# EAGLE schematic AQ_sensor_GSM (EAGLE 9.6.2)

## Sheet 1 of 6: Control Board
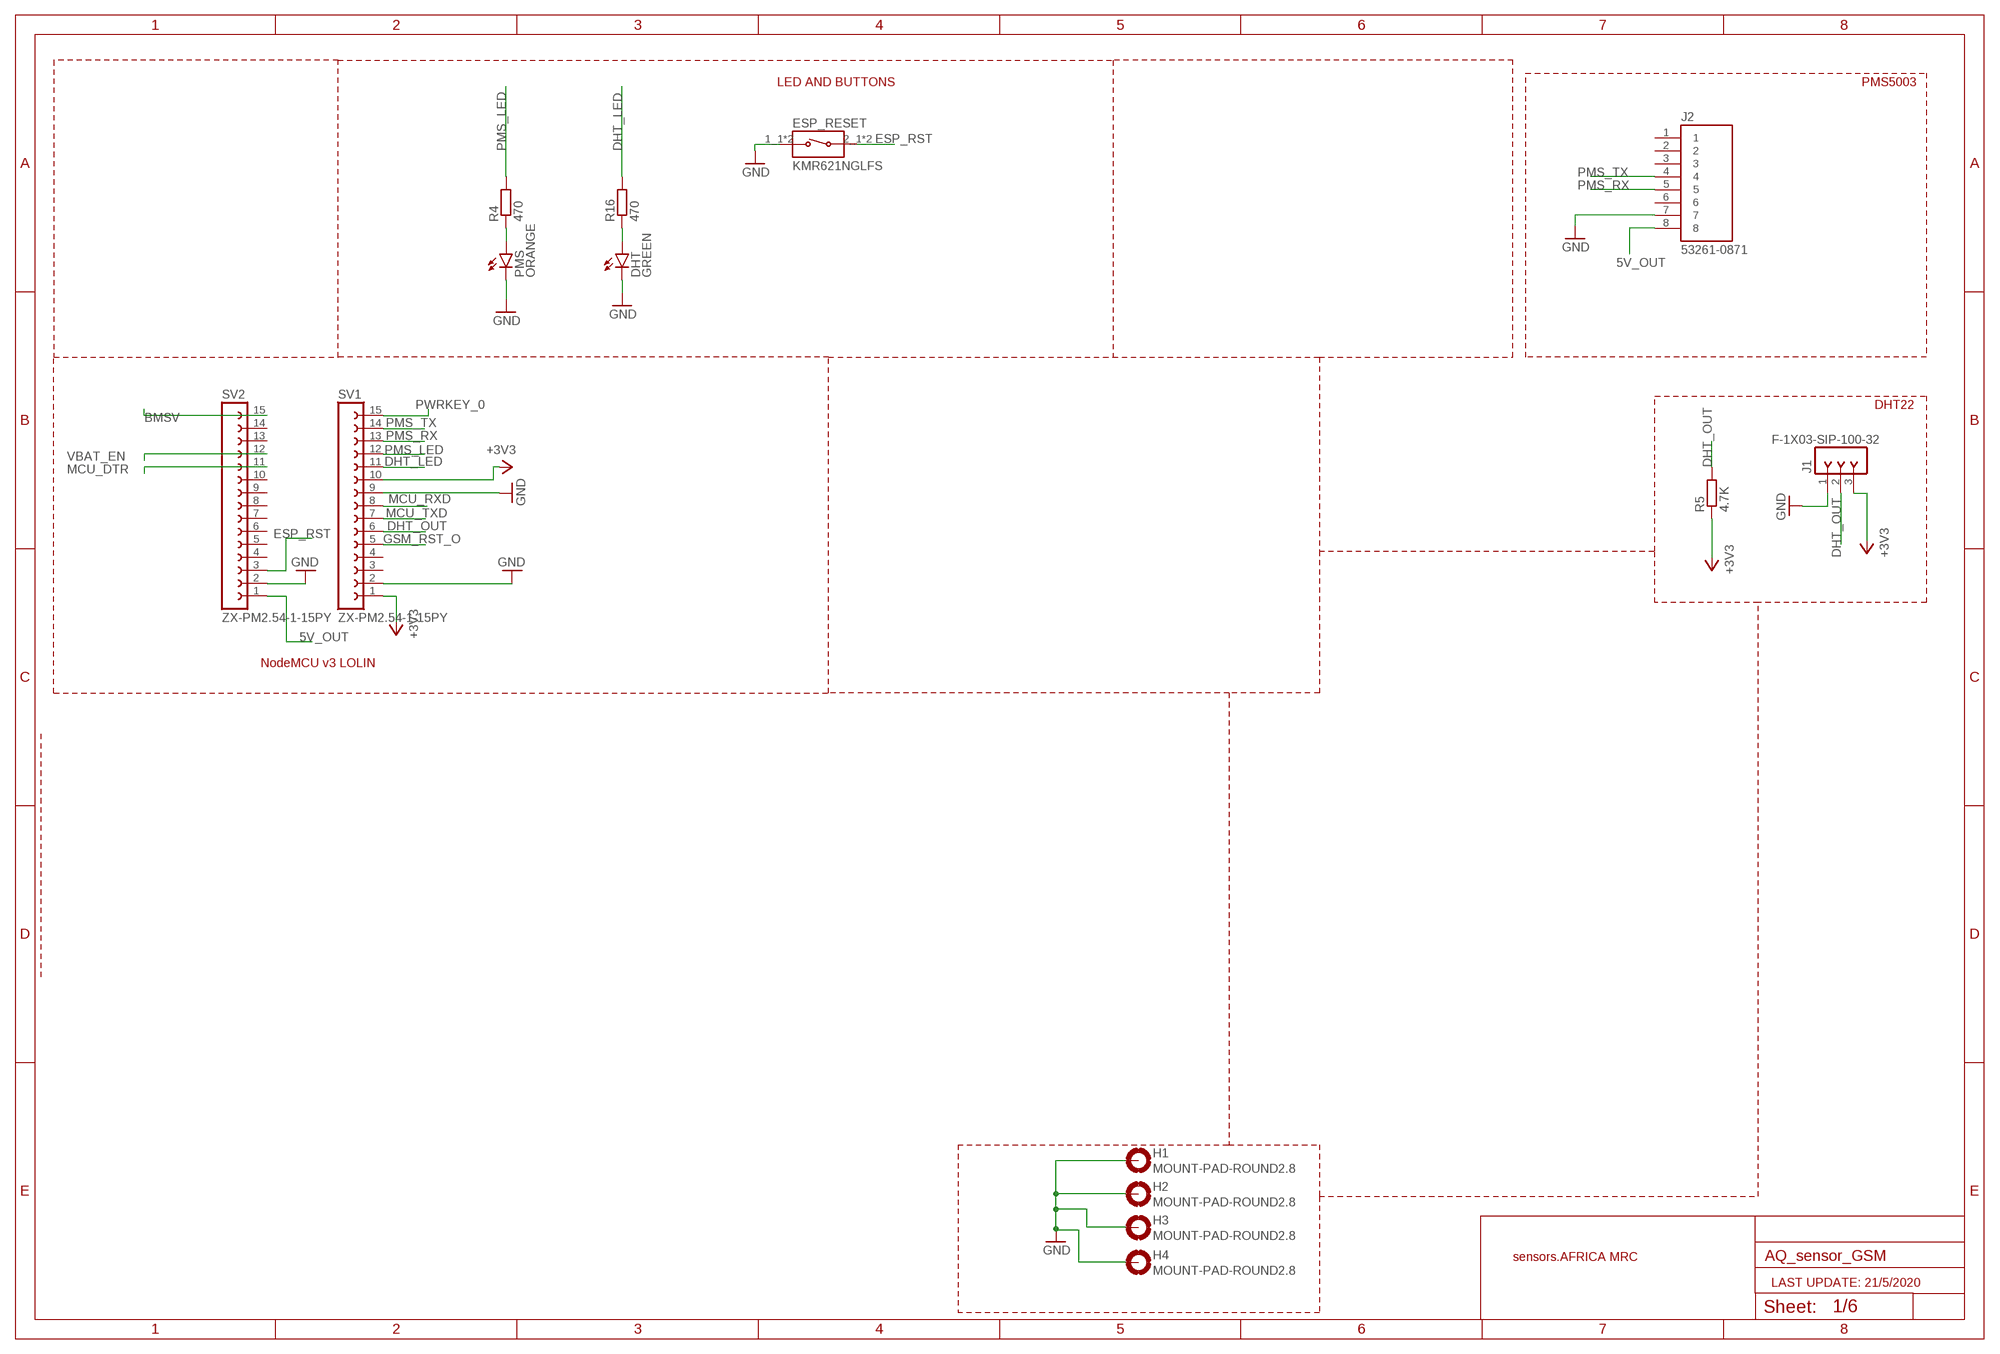
[diagram p0: schematic, sheet 1]

### Parts
DHT  GREEN  LEDCHIP-LED0603  [CHIP-LED0603]
ESP_RESET  KMR621NGLFS  [SW_KMR621NGLFS]
H1  MOUNT-PAD-ROUND2.8  [2,8-PAD]
H2  MOUNT-PAD-ROUND2.8  [2,8-PAD]
H3  MOUNT-PAD-ROUND2.8  [2,8-PAD]
H4  MOUNT-PAD-ROUND2.8  [2,8-PAD]
J1  F-1X03-SIP-100-32  [SIP-100-03-32]
J2  53261-0871  [MOLEX_53261-0871]
PMS  ORANGE  LEDCHIP-LED0603  [CHIP-LED0603]
R4  470  R-EU_R0603  [R0603]
R5  4.7K  R-EU_R0603  [R0603]
R16  470  R-EU_R0603  [R0603]
SV1  ZX-PM2.54-1-15PY  FE15-1  [FE15]
SV2  ZX-PM2.54-1-15PY  FE15-1  [FE15]

### Nets
5V_OUT [HCurrent]: J2.8 SV2.1 ; also sheet 4
+3V3 [POWER]: J1.3 R5.1 SV1.1 SV1.10 ; also sheet 2,4
BMSV: SV2.15 ; also sheet 4
DHT_LED: R16.2 SV1.11
DHT_OUT: J1.2 R5.2 SV1.6
ESP_RST: ESP_RESET.2_1 ESP_RESET.2_2 SV2.3
GND: DHT.C ESP_RESET.1_1 ESP_RESET.1_2 H1.B2,8(MOUNT) H2.B2,8(MOUNT) H3.B2,8(MOUNT) H4.B2,8(MOUNT) J1.1 J2.7 PMS.C SV1.2 SV1.9 SV2.2 ; also sheet 2,3,4,5
GSM_RST_O: SV1.5 ; also sheet 2
MCU_DTR: SV2.11 ; also sheet 2
MCU_RXD: SV1.8 ; also sheet 2,3
MCU_TXD: SV1.7 ; also sheet 2,3
N$4: PMS.A R4.1
N$27: DHT.A R16.1
PMS_LED: R4.2 SV1.12
PMS_RX: J2.5 SV1.13
PMS_TX: J2.4 SV1.14
PWRKEY_0: SV1.15 ; also sheet 2
VBAT_EN: SV2.12
Unconnected: J2.1 J2.2 J2.3 J2.6 SV1.3 SV1.4 SV2.4 SV2.5 SV2.6 SV2.7 SV2.8 SV2.9 SV2.10 SV2.13 SV2.14

### Notes on the sheet
- LED AND BUTTONS | PMS5003
- DHT22
- NodeMCU v3 LOLIN
- sensors.AFRICA MRC
- LAST UPDATE: 21/5/2020

## Sheet 2 of 6: Protection and Logic Level Converters
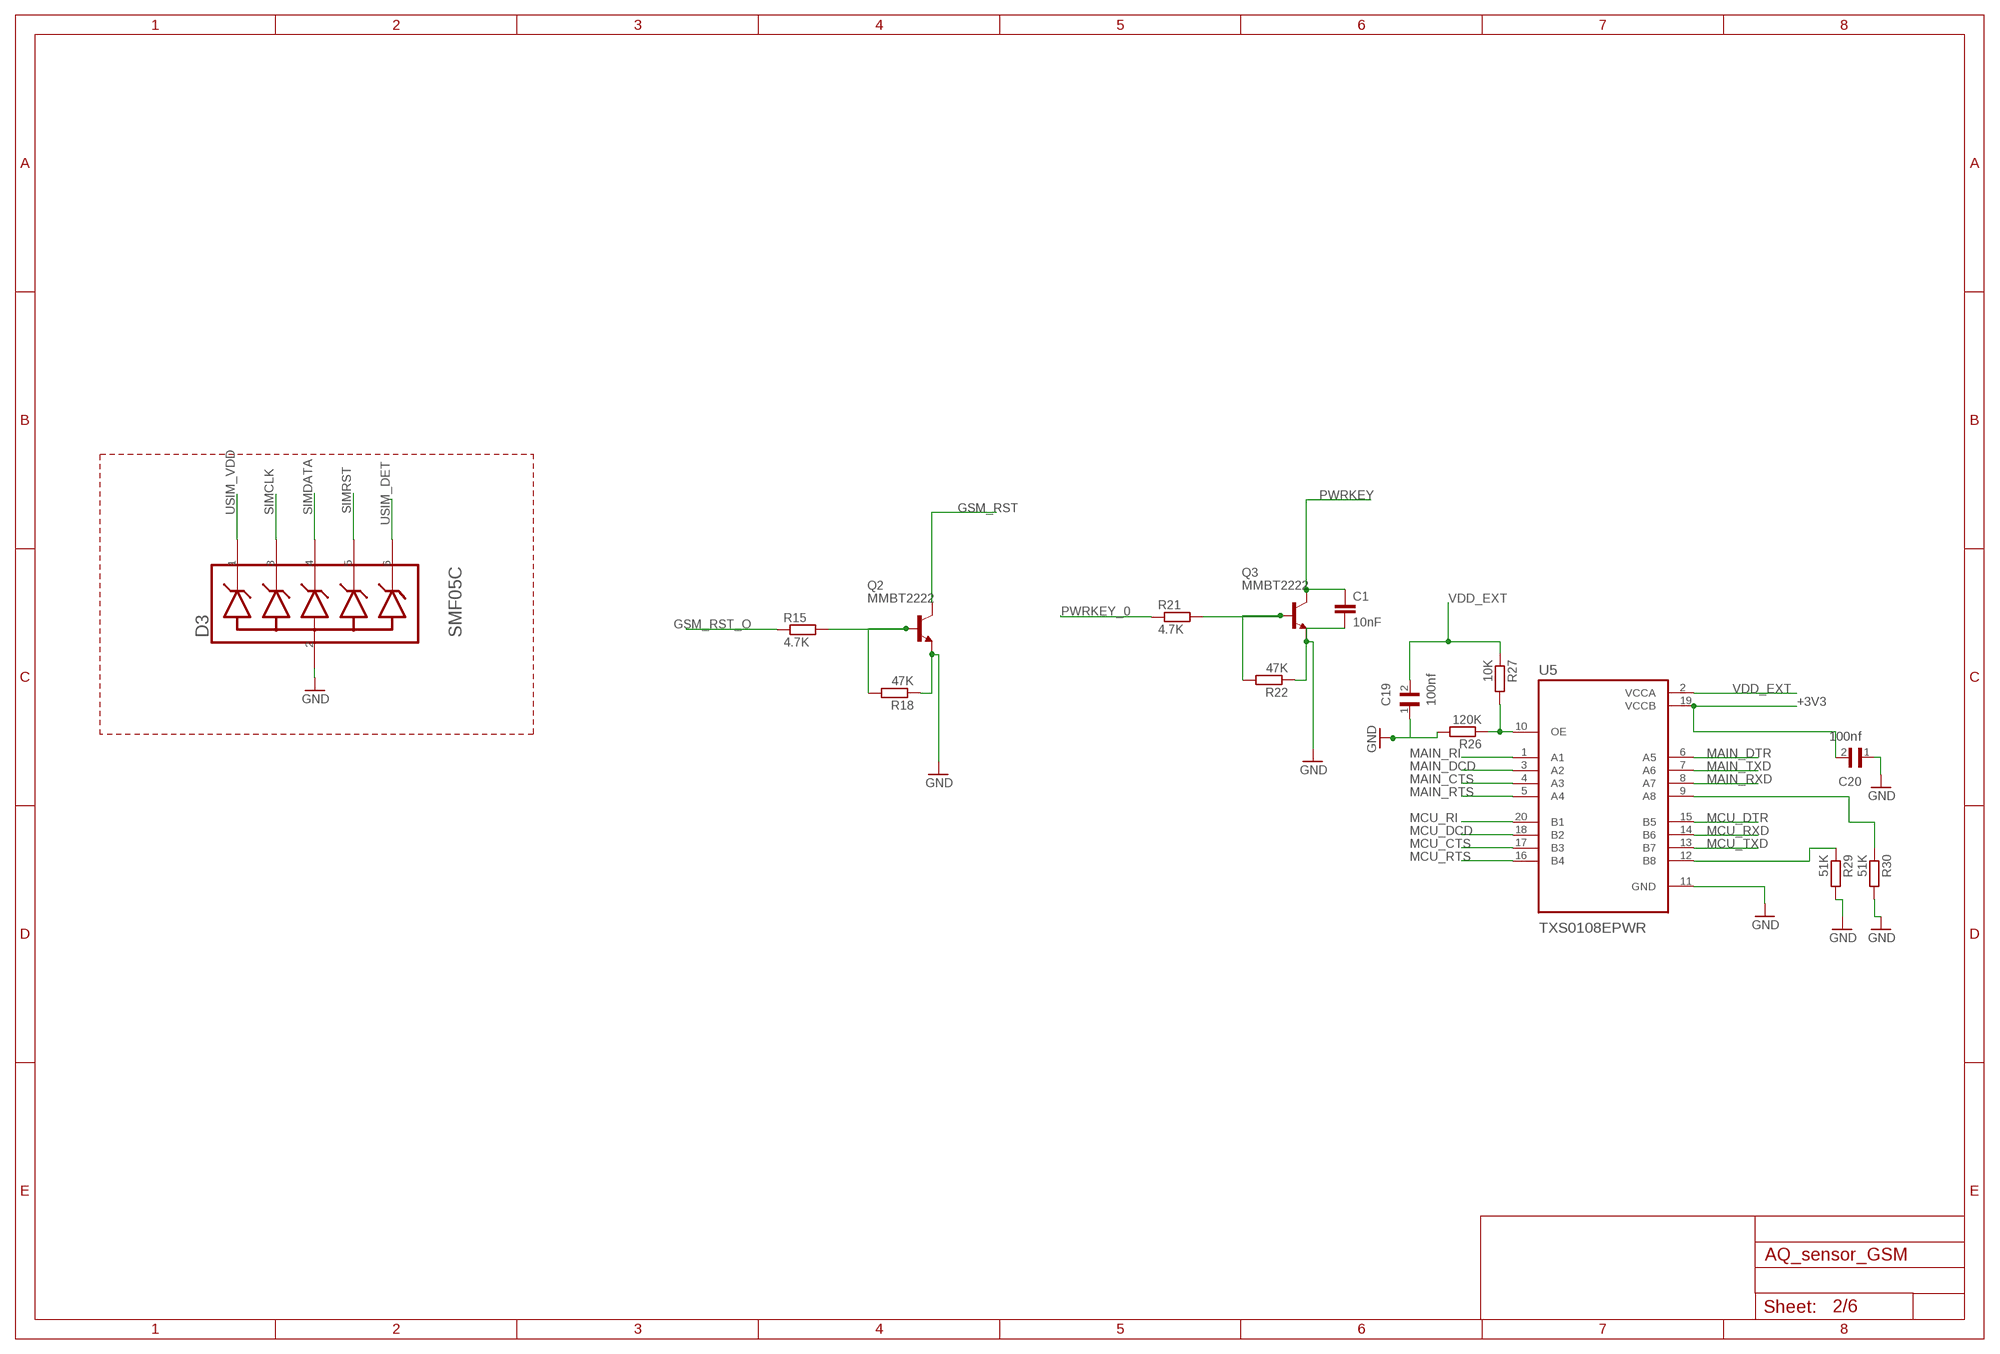
[diagram p1: schematic, sheet 2]

### Parts
C1  10nF  10NF-0603-50V-10%  [0603]
C19  100nf  06035C104K4T2A  [CAPC1608X90N]
C20  100nf  06035C104K4T2A  [CAPC1608X90N]
D3  SEMTECH_SMF05CSEMTECH_SMF05C_0_0  [SEMTECH_SMF05C_0]
Q2  MMBT2222  [SOT23-BEC]
Q3  MMBT2222  [SOT23-BEC]
R15  4.7K  R-EU_R0603  [R0603]
R18  47K  R-EU_R0603  [R0603]
R21  4.7K  R-EU_R0603  [R0603]
R22  47K  R-EU_R0603  [R0603]
R26  120K  R-EU_R0603  [R0603]
R27  10K  R-EU_R0603  [R0603]
R29  51K  R-EU_R0603  [R0603]
R30  51K  R-EU_R0603  [R0603]
U5  TXS0108EPWR  [SOP65P640X120-20N]

### Nets
+3V3 [POWER]: C20.2 U5.19(VCCB) ; also sheet 1,4
GND: C1.2 C19.1 C20.1 D3.2(ANODE) Q2.E Q3.E R18.1 R22.1 R26.2 R29.2 R30.2 U5.11(GND) ; also sheet 1,3,4,5
GSM_RST [BGA]: Q2.C ; also sheet 3,5
GSM_RST_O: R15.1 ; also sheet 1
MAIN_CTS: U5.4(A3) ; also sheet 3
MAIN_DCD: U5.3(A2) ; also sheet 3
MAIN_DTR: U5.6(A5) ; also sheet 3
MAIN_RI [BGA]: U5.1(A1) ; also sheet 3,5
MAIN_RTS: U5.5(A4) ; also sheet 3
MAIN_RXD: U5.8(A7) ; also sheet 3
MAIN_TXD: U5.7(A6) ; also sheet 3
MCU_CTS: U5.17(B3)
MCU_DCD: U5.18(B2)
MCU_DTR: U5.15(B5) ; also sheet 1
MCU_RI: U5.20(B1)
MCU_RTS: U5.16(B4)
MCU_RXD: U5.14(B6) ; also sheet 1,3
MCU_TXD: U5.13(B7) ; also sheet 1,3
N$1: Q2.B R15.2 R18.2
N$2: Q3.B R21.2 R22.2
N$31: R26.1 R27.2 U5.10(OE)
N$40: R30.1 U5.9(A8)
N$41: R29.1 U5.12(B8)
PWRKEY [BGA]: C1.1 Q3.C ; also sheet 3
PWRKEY_0: R21.1 ; also sheet 1
SIMCLK [BGA]: D3.3(2_CATHODE) ; also sheet 3
SIMDATA: D3.4(3_CATHODE) ; also sheet 3
SIMRST: D3.5(4_CATHODE) ; also sheet 3
USIM_DET: D3.6(5_CATHODE) ; also sheet 3
USIM_VDD: D3.1(1_CATHODE) ; also sheet 3
VDD_EXT: C19.2 R27.1 U5.2(VCCA) ; also sheet 3

## Sheet 3 of 6: GSM
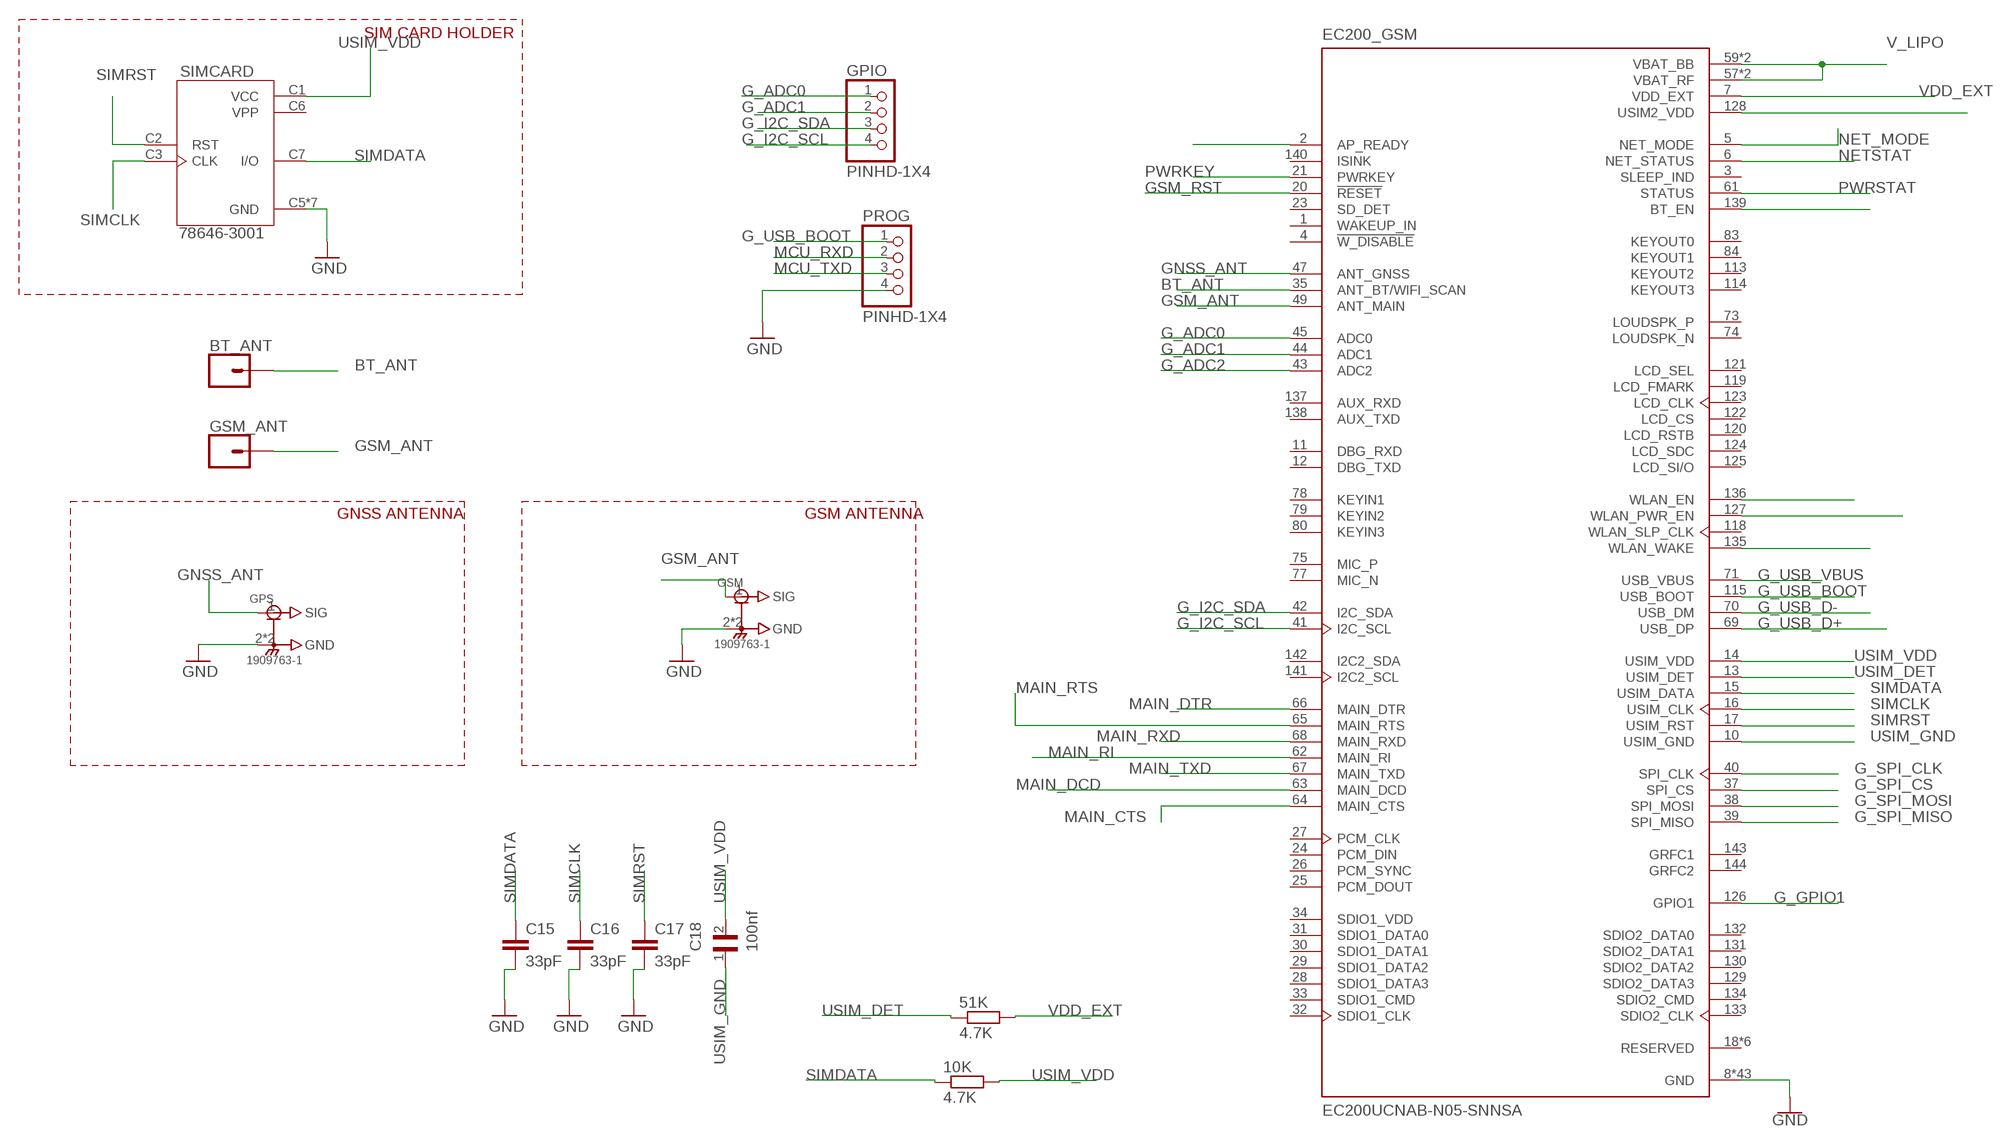
[diagram p2: schematic, sheet 3]

### Parts
10K  4.7K  R-EU_R0603  [R0603]
51K  4.7K  R-EU_R0603  [R0603]
BT_ANT  CONN_01  [1X01]
C15  33pF  C-EUC0603  [C0603]
C16  33pF  C-EUC0603  [C0603]
C17  33pF  C-EUC0603  [C0603]
C18  100nf  06035C104K4T2A  [CAPC1608X90N]
EC200_GSM  EC200UCNAB-N05-SNNSA  [XCVR_EC200UCNAB-N05-SNNSA]
GPIO  PINHD-1X4  [1X04]
GPS  1909763-1  [TE_1909763-1]
GSM  1909763-1  [TE_1909763-1]
GSM_ANT  CONN_01  [1X01]
PROG  PINHD-1X4  [1X04]
SIMCARD  78646-3001  [MOLEX_78646-3001]

### Nets
BT_ANT [HCurrent]: BT_ANT.1 EC200_GSM.35(ANT_BT/WIFI_SCAN)
G_ADC0: EC200_GSM.45(ADC0) GPIO.1
G_ADC1: EC200_GSM.44(ADC1) GPIO.2
G_ADC2: EC200_GSM.43(ADC2)
G_GPIO1: EC200_GSM.126(GPIO1)
G_I2C_SCL: EC200_GSM.41(I2C_SCL) GPIO.4
G_I2C_SDA: EC200_GSM.42(I2C_SDA) GPIO.3
G_SPI_CLK: EC200_GSM.40(SPI_CLK)
G_SPI_CS: EC200_GSM.37(SPI_CS)
G_SPI_MISO: EC200_GSM.39(SPI_MISO)
G_SPI_MOSI: EC200_GSM.38(SPI_MOSI)
G_USB_BOOT: EC200_GSM.115(USB_BOOT) PROG.1
G_USB_D+: EC200_GSM.69(USB_DP) ; also sheet 4
G_USB_D-: EC200_GSM.70(USB_DM) ; also sheet 4
G_USB_VBUS: EC200_GSM.71(USB_VBUS)
GND: C15.2 C16.2 C17.2 EC200_GSM.8(GND) EC200_GSM.9(GND) EC200_GSM.19(GND) EC200_GSM.22(GND) EC200_GSM.36(GND) EC200_GSM.46(GND) EC200_GSM.48(GND) EC200_GSM.50(GND) EC200_GSM.51(GND) EC200_GSM.52(GND) EC200_GSM.53(GND) EC200_GSM.54(GND) EC200_GSM.56(GND) EC200_GSM.72(GND) EC200_GSM.76(GND) EC200_GSM.85(GND) EC200_GSM.86(GND) EC200_GSM.87(GND) EC200_GSM.88(GND) EC200_GSM.89(GND) EC200_GSM.90(GND) EC200_GSM.91(GND) EC200_GSM.92(GND) EC200_GSM.93(GND) EC200_GSM.94(GND) EC200_GSM.95(GND) EC200_GSM.96(GND) EC200_GSM.97(GND) EC200_GSM.98(GND) EC200_GSM.99(GND) EC200_GSM.100(GND) EC200_GSM.101(GND) EC200_GSM.102(GND) EC200_GSM.103(GND) EC200_GSM.104(GND) EC200_GSM.105(GND) EC200_GSM.106(GND) EC200_GSM.107(GND) EC200_GSM.108(GND) EC200_GSM.109(GND) EC200_GSM.110(GND) EC200_GSM.111(GND) EC200_GSM.112(GND) GPS.2(GND) GPS.3(GND) GSM.2(GND) GSM.3(GND) PROG.4 SIMCARD.C5(GND) SIMCARD.G1(GND) SIMCARD.G2(GND) SIMCARD.G3(GND) SIMCARD.G4(GND) SIMCARD.G5(GND) SIMCARD.G6(GND) ; also sheet 1,2,4,5
GNSS_ANT [HCurrent]: EC200_GSM.47(ANT_GNSS) GPS.1(SIG)
GSM_ANT [HCurrent]: EC200_GSM.49(ANT_MAIN) GSM.1(SIG) GSM_ANT.1
GSM_RST [BGA]: EC200_GSM.20(!RESET) ; also sheet 2,5
MAIN_CTS: EC200_GSM.64(MAIN_CTS) ; also sheet 2
MAIN_DCD: EC200_GSM.63(MAIN_DCD) ; also sheet 2
MAIN_DTR: EC200_GSM.66(MAIN_DTR) ; also sheet 2
MAIN_RI [BGA]: EC200_GSM.62(MAIN_RI) ; also sheet 2,5
MAIN_RTS: EC200_GSM.65(MAIN_RTS) ; also sheet 2
MAIN_RXD: EC200_GSM.68(MAIN_RXD) ; also sheet 2
MAIN_TXD: EC200_GSM.67(MAIN_TXD) ; also sheet 2
MCU_RXD: PROG.2 ; also sheet 1,2
MCU_TXD: PROG.3 ; also sheet 1,2
N$5: EC200_GSM.128(USIM2_VDD)
N$7: EC200_GSM.139(BT_EN)
N$8: EC200_GSM.136(WLAN_EN)
N$15: EC200_GSM.127(WLAN_PWR_EN)
N$16: EC200_GSM.135(WLAN_WAKE)
N$23: EC200_GSM.2(AP_READY)
NET_MODE: EC200_GSM.5(NET_MODE) ; also sheet 5
NETSTAT [BGA]: EC200_GSM.6(NET_STATUS) ; also sheet 5
PWRKEY [BGA]: EC200_GSM.21(PWRKEY) ; also sheet 2
PWRSTAT: EC200_GSM.61(STATUS) ; also sheet 5
SIMCLK [BGA]: C16.1 EC200_GSM.16(USIM_CLK) SIMCARD.C3(CLK) ; also sheet 2
SIMDATA: 10K.1 C15.1 EC200_GSM.15(USIM_DATA) SIMCARD.C7(I/O) ; also sheet 2
SIMRST: C17.1 EC200_GSM.17(USIM_RST) SIMCARD.C2(RST) ; also sheet 2
USIM_DET: 51K.1 EC200_GSM.13(USIM_DET) ; also sheet 2
USIM_GND: C18.1 EC200_GSM.10(USIM_GND)
USIM_VDD: 10K.2 C18.2 EC200_GSM.14(USIM_VDD) SIMCARD.C1(VCC) ; also sheet 2
V_LIPO [HCurrent]: EC200_GSM.57(VBAT_RF) EC200_GSM.58(VBAT_RF) EC200_GSM.59(VBAT_BB) EC200_GSM.60(VBAT_BB) ; also sheet 4,5
VDD_EXT: 51K.2 EC200_GSM.7(VDD_EXT) ; also sheet 2
Unconnected: EC200_GSM.1(WAKEUP_IN) EC200_GSM.3(SLEEP_IND) EC200_GSM.4(!W_DISABLE) EC200_GSM.11(DBG_RXD) EC200_GSM.12(DBG_TXD) EC200_GSM.18(RESERVED) EC200_GSM.23(SD_DET) EC200_GSM.24(PCM_DIN) EC200_GSM.25(PCM_DOUT) EC200_GSM.26(PCM_SYNC) EC200_GSM.27(PCM_CLK) EC200_GSM.28(SDIO1_DATA3) EC200_GSM.29(SDIO1_DATA2) EC200_GSM.30(SDIO1_DATA1) EC200_GSM.31(SDIO1_DATA0) EC200_GSM.32(SDIO1_CLK) EC200_GSM.33(SDIO1_CMD) EC200_GSM.55(RESERVED) EC200_GSM.73(LOUDSPK_P) EC200_GSM.74(LOUDSPK_N) EC200_GSM.75(MIC_P) EC200_GSM.77(MIC_N) EC200_GSM.78(KEYIN1) EC200_GSM.79(KEYIN2) EC200_GSM.80(KEYIN3) EC200_GSM.81(RESERVED) EC200_GSM.82(RESERVED) EC200_GSM.83(KEYOUT0) EC200_GSM.84(KEYOUT1) EC200_GSM.113(KEYOUT2) EC200_GSM.114(KEYOUT3) EC200_GSM.116(RESERVED) EC200_GSM.117(RESERVED) EC200_GSM.118(WLAN_SLP_CLK) EC200_GSM.119(LCD_FMARK) EC200_GSM.120(LCD_RSTB) EC200_GSM.121(LCD_SEL) EC200_GSM.122(LCD_CS) EC200_GSM.123(LCD_CLK) EC200_GSM.124(LCD_SDC) EC200_GSM.125(LCD_SI/O) EC200_GSM.129(SDIO2_DATA3) EC200_GSM.130(SDIO2_DATA2) EC200_GSM.131(SDIO2_DATA1) EC200_GSM.132(SDIO2_DATA0) EC200_GSM.133(SDIO2_CLK) EC200_GSM.134(SDIO2_CMD) EC200_GSM.137(AUX_RXD) EC200_GSM.138(AUX_TXD) EC200_GSM.140(ISINK) EC200_GSM.141(I2C2_SCL) EC200_GSM.142(I2C2_SDA) EC200_GSM.143(GRFC1) EC200_GSM.144(GRFC2)

### Notes on the sheet
- SIM CARD HOLDER
- GNSS ANTENNA | GSM ANTENNA

## Sheet 4 of 6: POWER CIRCUIT
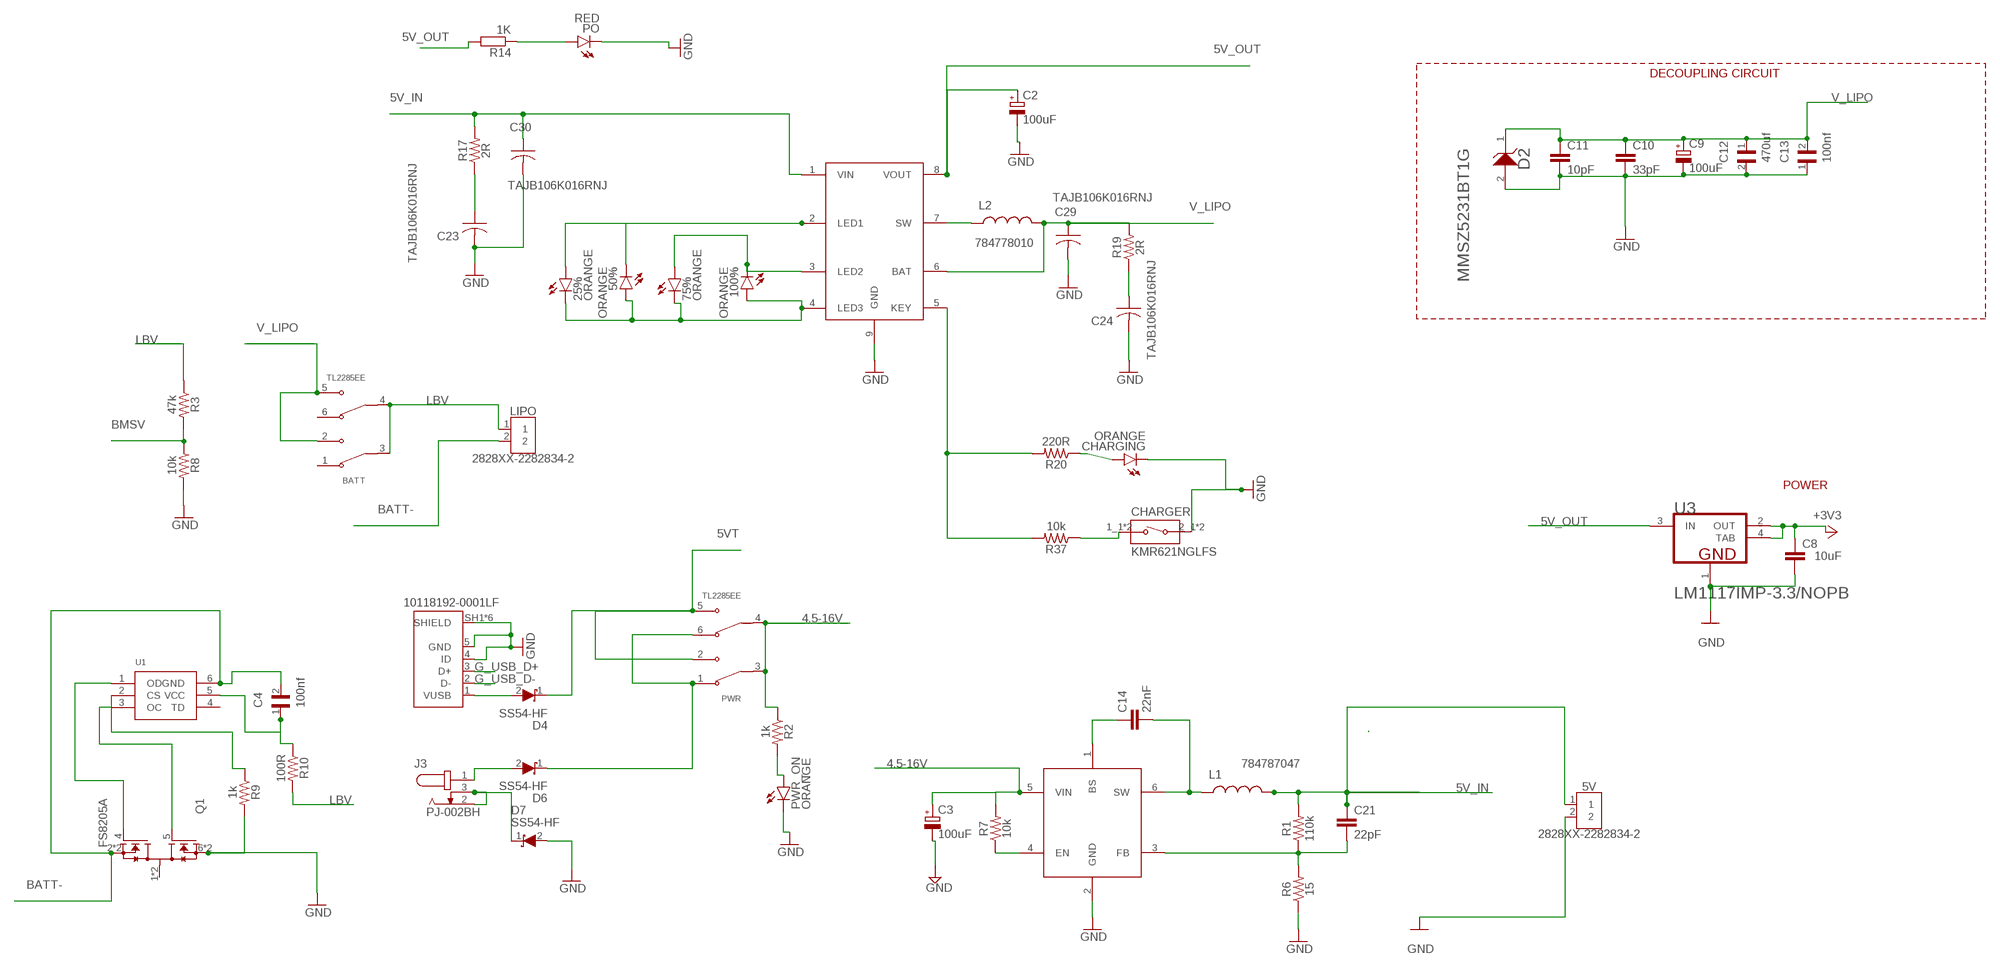
[diagram p3: schematic, sheet 4]

### Parts
5V  2828XX-2282834-2  [TERMBLK_254-2N]
25%  ORANGE  LEDCHIP-LED0603  [CHIP-LED0603]
50%  ORANGE  LEDCHIP-LED0603  [CHIP-LED0603]
75%  ORANGE  LEDCHIP-LED0603  [CHIP-LED0603]
100%  ORANGE  LEDCHIP-LED0603  [CHIP-LED0603]
BATT  TL2285EE  [SW_TL2285EE]
C2  100uF  CPOL-EUD  [PANASONIC_D]
C3  100uF  CPOL-EUD  [PANASONIC_D]
C4  100nf  06035C104K4T2A  [CAPC1608X90N]
C8  10uF  C-EUC0603  [C0603]
C9  100uF  CPOL-EUD  [PANASONIC_D]
C10  33pF  C-EUC0603  [C0603]
C11  10pF  C-EUC0603  [C0603]
C12  470uf  T495X477K010ATE100  [CAPMP7343X430N]
C13  100nf  06035C104K4T2A  [CAPC1608X90N]
C14  22nF  220PF-0402T-50V-5%  [0402-TIGHT]
C21  22pF  220PF-0402T-50V-5%  [0402-TIGHT]
C23  TAJB106K016RNJ  [CAP_TANT_B]
C24  TAJB106K016RNJ  [CAP_TANT_B]
C29  TAJB106K016RNJ  [CAP_TANT_B]
C30  TAJB106K016RNJ  [CAP_TANT_B]
CHARGER  KMR621NGLFS  [SW_KMR621NGLFS]
CHARGING  ORANGE  LEDCHIP-LED0603  [CHIP-LED0603]
D2  ON_SEMICONDUCTOR_MMSZ5231BT1GON_SEMICONDUCTOR_MMSZ5231BT1G_0_0  [ON_SEMICONDUCTOR_MMSZ5231BT1G_0]
D4  SS54-HF  [DIOM5025X220N]
D6  SS54-HF  [DIOM5025X220N]
D7  SS54-HF  [DIOM5025X220N]
J3  PJ-002BH  [CUI_PJ-002BH]
L1  784787047  [784787047]
L2  784778010  [784778010]
LIPO  2828XX-2282834-2  [TERMBLK_254-2N]
MT2492  MT2492  MT2492MT2492  [SOT95P280X145-6N]
PB_IN  10118192-0001LF  [AMPHENOL_10118192-0001LF]
PO  RED  LEDCHIP-LED0603  [CHIP-LED0603]
PWR  TL2285EE  [SW_TL2285EE]
PWR_ON  ORANGE  LEDCHIP-LED0603  [CHIP-LED0603]
Q1  FS8205A  [SOP65P640X120-8N]
R1  110k  1.20KOHM-0603-1/10W-1%  [0603]
R2  1k  1.20KOHM-0603-1/10W-1%  [0603]
R3  47k  1.20KOHM-0603-1/10W-1%  [0603]
R6  15  1.20KOHM-0603-1/10W-1%  [0603]
R7  10k  1.20KOHM-0603-1/10W-1%  [0603]
R8  10k  1.20KOHM-0603-1/10W-1%  [0603]
R9  1k  1.20KOHM-0603-1/10W-1%  [0603]
R10  100R  1.20KOHM-0603-1/10W-1%  [0603]
R14  1K  R-EU_R0603  [R0603]
R17  2R  1.20KOHM-0603-1/10W-1%  [0603]
R19  2R  1.20KOHM-0603-1/10W-1%  [0603]
R20  220R  1.20KOHM-0603-1/10W-1%  [0603]
R37  10k  1.20KOHM-0603-1/10W-1%  [0603]
U1  DW01-P  [SOT23-6L]
U3  TEXAS_INSTRUMENTS_LM1117IMP-3.3-NOPBTEXAS_INSTRUMENTS_LM1117IMP-3.3-NOPB_0_0  [TEXAS_INSTRUMENTS_LM1117IMP-3.3-NOPB_0]
U$2  IP5306IP5306  [SOIC127P600X165-9T209N]

### Nets
4.5-16V [HCurrent]: C3.+ MT2492.5(VIN) PWR.3(COM1) PWR.4(COM2) R2.1 R7.2
5V_IN [HCurrent]: 5V.1 C21.1 C30.1 L1.2 R1.2 R17.2 U$2.1(VIN)
5V_OUT [HCurrent]: C2.+ R14.2 U3.3(IN) U$2.8(VOUT) ; also sheet 1
5VT [HCurrent]: D4.1(K) PWR.2(NO1) PWR.5(NO2)
+3V3 [POWER]: C8.1 U3.2(OUT) U3.4(TAB) ; also sheet 1,2
BATT- [HCurrent]: C4.2 LIPO.2 Q1.2(S1) Q1.3(S1) U1.6(GND)
BMSV: R3.2 R8.1 ; also sheet 1
G_USB_D+: PB_IN.3(D+) ; also sheet 3
G_USB_D-: PB_IN.2(D-) ; also sheet 3
GND: 5V.2 C2.- C3.- C8.2 C9.- C10.2 C11.2 C12.2 C13.1 C23.2 C24.2 C29.2 C30.2 CHARGER.2_1 CHARGER.2_2 CHARGING.C D2.2(A) D7.2(A) MT2492.2(GND) PB_IN.4(ID) PB_IN.5(GND) PB_IN.SH1(SHIELD) PB_IN.SH2(SHIELD) PB_IN.SH3(SHIELD) PB_IN.SH4(SHIELD) PB_IN.SH5(SHIELD) PB_IN.SH6(SHIELD) PO.C PWR_ON.C Q1.6(S2) Q1.7(S2) R6.1 R8.2 R9.2 U3.1(GND) U$2.9(GND) ; also sheet 1,2,3,5
LBV [HCurrent]: BATT.3(COM1) BATT.4(COM2) LIPO.1 R3.1 R10.2
N$3: C14.1 MT2492.1(BS)
N$6: C14.2 L1.1 MT2492.6(SW)
N$9: Q1.4(G1) U1.1(OD)
N$10: C21.2 MT2492.3(FB) R1.1 R6.2
N$11: MT2492.4(EN) R7.1
N$13: C23.1 R17.1
N$14: 25%.C 50%.A 75%.C 100%.A U$2.4(LED3)
N$17: 25%.A 50%.C U$2.2(LED1)
N$18: 75%.A 100%.C U$2.3(LED2)
N$19: Q1.5(G2) U1.3(OC)
N$20: CHARGER.1_1 CHARGER.1_2 R37.1
N$21: L2.1 U$2.7(SW)
N$24: C24.1 R19.1
N$25: PO.A R14.1
N$35: PWR_ON.A R2.2
N$37: C4.1 R10.1 U1.5(VCC)
N$45: R20.2 R37.2 U$2.5(KEY)
N$46: CHARGING.A R20.1
N$47: R9.1 U1.2(CS)
N$59: D4.2(A) PB_IN.1(VUSB)
N$60: D7.1(K) J3.2 J3.3
N$61: D6.2(A) J3.1
V_LIPO [HCurrent]: BATT.2(NO1) BATT.5(NO2) C9.+ C10.1 C11.1 C12.1 C13.2 C29.1 D2.1(K) L2.2 R19.2 U$2.6(BAT) ; also sheet 3,5
VUSB [HCurrent]: D6.1(K) PWR.1(NC1) PWR.6(NC2)
Unconnected: BATT.1(NC1) BATT.6(NC2) Q1.1(D12) Q1.8(D12) U1.4(TD)

### Notes on the sheet
- DECOUPLING CIRCUIT
- POWER

## Sheet 5 of 6: LEDs and Buttons
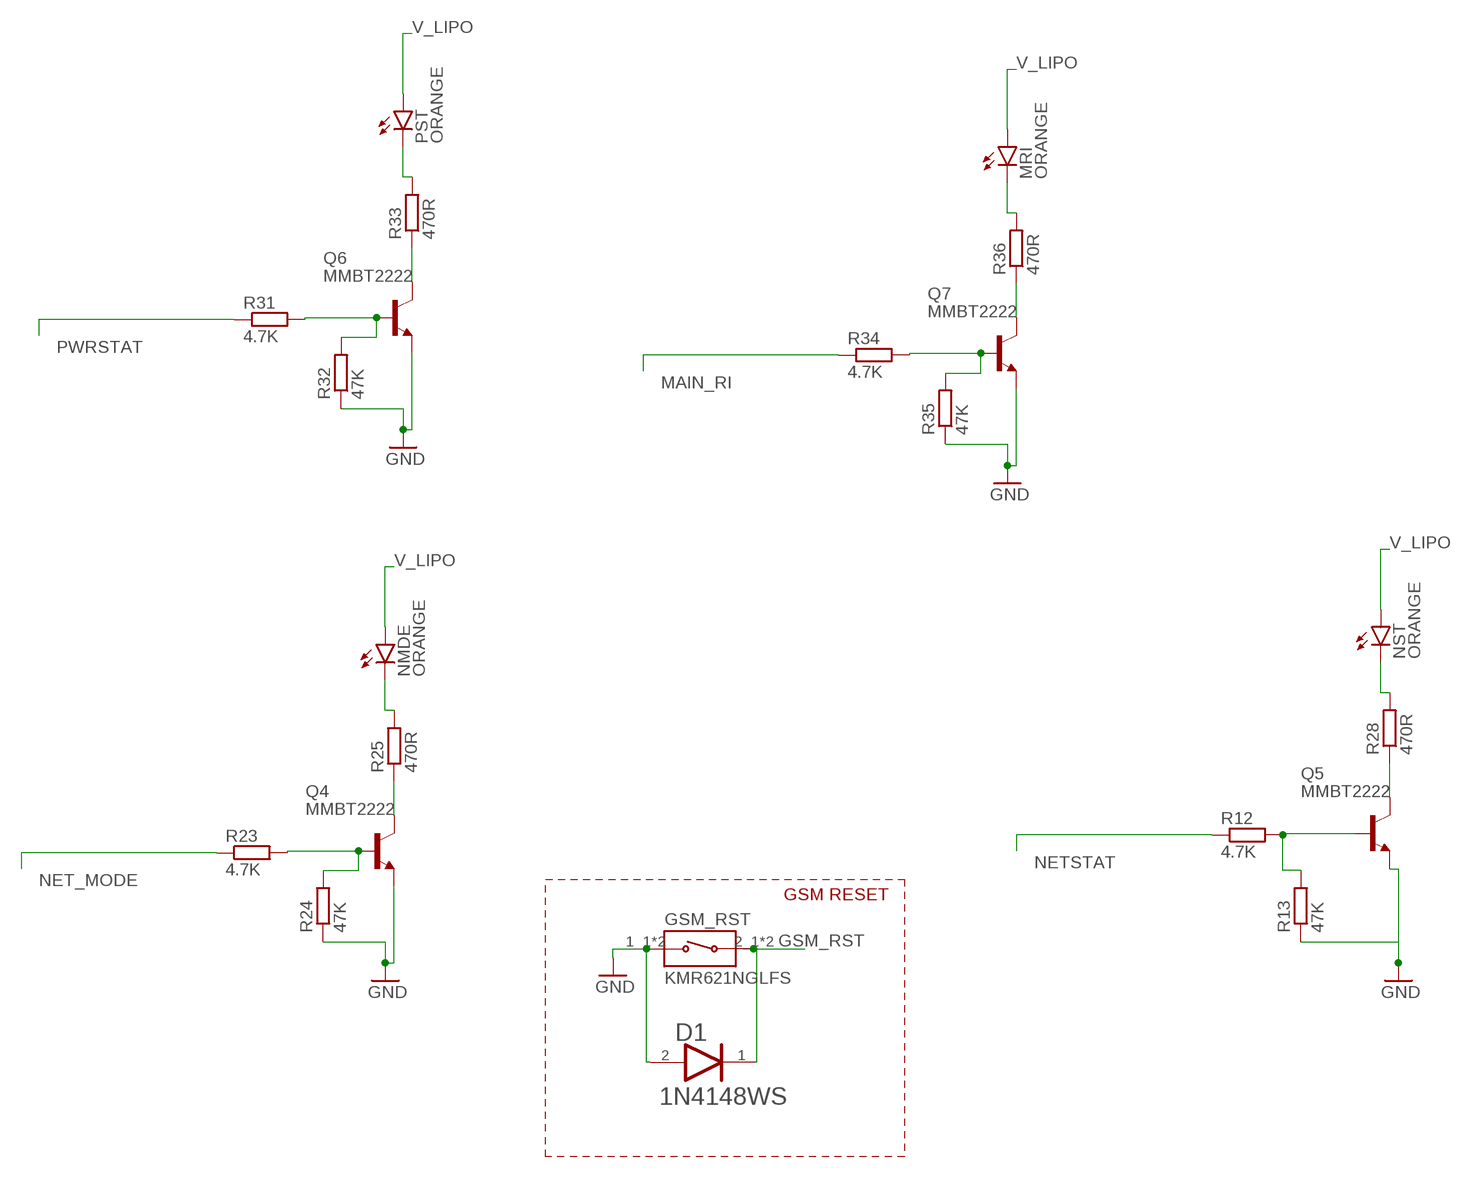
[diagram p4: schematic, sheet 5]

### Parts
D1  ON_SEMI_1N4148WSON_SEMI_1N4148WS_0_0  [ON_SEMI_1N4148WS_0]
GSM_RST  KMR621NGLFS  [SW_KMR621NGLFS]
MRI  ORANGE  LEDCHIP-LED0603  [CHIP-LED0603]
NMDE  ORANGE  LEDCHIP-LED0603  [CHIP-LED0603]
NST  ORANGE  LEDCHIP-LED0603  [CHIP-LED0603]
PST  ORANGE  LEDCHIP-LED0603  [CHIP-LED0603]
Q4  MMBT2222  [SOT23-BEC]
Q5  MMBT2222  [SOT23-BEC]
Q6  MMBT2222  [SOT23-BEC]
Q7  MMBT2222  [SOT23-BEC]
R12  4.7K  R-EU_R0603  [R0603]
R13  47K  R-EU_R0603  [R0603]
R23  4.7K  R-EU_R0603  [R0603]
R24  47K  R-EU_R0603  [R0603]
R25  470R  R-EU_R0603  [R0603]
R28  470R  R-EU_R0603  [R0603]
R31  4.7K  R-EU_R0603  [R0603]
R32  47K  R-EU_R0603  [R0603]
R33  470R  R-EU_R0603  [R0603]
R34  4.7K  R-EU_R0603  [R0603]
R35  47K  R-EU_R0603  [R0603]
R36  470R  R-EU_R0603  [R0603]

### Nets
GND: D1.2(ANODE) GSM_RST.1_1 GSM_RST.1_2 Q4.E Q5.E Q6.E Q7.E R13.1 R24.1 R32.1 R35.1 ; also sheet 1,2,3,4
GSM_RST [BGA]: D1.1(CATHODE) GSM_RST.2_1 GSM_RST.2_2 ; also sheet 2,3
MAIN_RI [BGA]: R34.1 ; also sheet 2,3
N$22: Q5.B R12.2 R13.2
N$26: Q4.B R23.2 R24.2
N$28: Q6.B R31.2 R32.2
N$29: Q4.C R25.1
N$30: NMDE.C R25.2
N$32: Q6.C R33.1
N$33: Q5.C R28.1
N$34: NST.C R28.2
N$39: PST.C R33.2
N$42: Q7.B R34.2 R35.2
N$43: Q7.C R36.1
N$44: MRI.C R36.2
NET_MODE: R23.1 ; also sheet 3
NETSTAT [BGA]: R12.1 ; also sheet 3
PWRSTAT: R31.1 ; also sheet 3
V_LIPO [HCurrent]: MRI.A NMDE.A NST.A PST.A ; also sheet 3,4

### Notes on the sheet
- GSM RESET

## Sheet 6 of 6: SD Card

## Power pins joined to a net without a drawn wire
SDIO1_VDD: EC200_GSM.34(SDIO1_VDD)
VPP: SIMCARD.C6(VPP)

## Library data of the parts
5V LIPO = Connector:2828XX-2: 2 Position Wire to Board Terminal Block Horizontal with Board Datasheet <https://www.te.com.cn/commerce/DocumentDelivery/DDEController?Action=showdoc&DocId=Catalog+Section%7F1308389_EUROSTYLE_TERMINAL_BLOCKS%7F0607%7Fpdf%7FEnglish%7FENG_CS_1308389_EUROSTYLE_TERMINAL_BLOCKS_0607.pdf%7F2-282837-5>; CATEGORY: Fixed Terminal Blocks; DESCRIPTION: Fixed Terminal Blocks 2P SIDE ENTRY 2.54mm; MANUFACTURER: TE Connectivity AMP Connectors; MPN: 282834-2; OPERATING_TEMPERATURE: -40°C ~ 105°C; PART_STATUS: Active; PITCH: 0.100" (2.54mm); ROHS_COMPLIANCE: RoHS Compliant; SERIES: Buchanan; SUBCATEGORY: Terminal Blocks; TYPE: Through Hole; Screw - Rising Cage Clamp; Side wire entry, Horizontal with Board
10K 51K R4 R5 R12-R16 R18 R21-R36 = rcl:R-EU_: RESISTOR, European symbol; SPICEPREFIX: R
25% 50% 75% 100% CHARGING DHT MRI NMDE NST PMS PO PST PWR_ON = led:LED: LED OSRAM: - CHIPLED LG R971, LG N971, LY N971, LG Q971, LY Q971, LO R971, LY R971 LH N974, LH R974 LS Q976, LO Q976, LY Q976 LO Q996 - Hyper CHIPLED LW Q18S LB Q993, LB Q99A, LB R99A - SideLED LS A670, LO A670, LY A670, LG A670, LP A670 LB A673, LV A673, LT A673, LW A673 LH A674 LY A675 LS A676, LA A676, LO A676, LY A676, LW A676 LS A679, LY A679, LG A679 - Hyper Micro SIDELED® LS Y876, LA Y876, LO Y876, LY Y876 LT Y87S - SmartLED LW L88C, LW L88S LB L89C, LB L89S, LG L890 LS L89K, LO L89K, LY L89K LS L896, LA L896, LO L896, LY L896 - TOPLED LS T670, LO T670, LY T670, LG T670, LP T670 LSG T670, LSP T670, LSY T670, LOP T670, LYG T670 LG T671, LOG T671, LSG T671 LB T673, LV T673, LT T673, LW T673 LH T674 LS T676, LA T676, LO T676, LY T676, LB T676, LH T676, LSB T676, LW T676 LB T67C, LV T67C, LT T67C, LS T67K, LO T67K, LY T67K, LW E67C LS E67B, LA E67B, LO E67B, LY E67B, LB E67C, LV E67C, LT E67C LW T67C LS T679, LY T679, LG T679 LS T770, LO T770, LY T770, LG T770, LP T770 LB T773, LV T773, LT T773, LW T773 LH T774 LS E675, LA E675, LY E675, LS T675 LS T776, LA T776, LO T776, LY T776, LB T776 LHGB T686 LT T68C, LB T68C - Hyper Mini TOPLED® LB M676 - Mini TOPLED Santana® LG M470 LS M47K, LO M47K, LY M47K Source: http://www.osram.convergy.de LUXEON: - LUMILED® LXK2-PW12-R00, LXK2-PW12-S00, LXK2-PW14-U00, LXK2-PW14-V00 LXK2-PM12-R00, LXK2-PM12-S00, LXK2-PM14-U00 LXK2-PE12-Q00, LXK2-PE12-R00, LXK2-PE12-S00, LXK2-PE14-T00, LXK2-PE14-U00 LXK2-PB12-K00, LXK2-PB12-L00, LXK2-PB12-M00, LXK2-PB14-N00, LXK2-PB14-P00, LXK2-PB14-Q00 LXK2-PR12-L00, LXK2-PR12-M00, LXK2-PR14-Q00, LXK2-PR14-R00 LXK2-PD12-Q00, LXK2-PD12-R00, LXK2-PD12-S00 LXK2-PH12-R00, LXK2-PH12-S00 LXK2-PL12-P00, LXK2-PL12-Q00, LXK2-PL12-R00 Source: www.luxeon.com KINGBRIGHT: KA-3528ASYC Source: www.kingbright.com
BATT PWR = TL2285EE:TL2285EE: Check availability <https://pricing.snapeda.com/parts/TL2285EE/E-Switch/view-part?ref=eda>; AVAILABILITY: In Stock; CHECK_PRICES: https://www.snapeda.com/parts/TL2285EE/E-Switch/view-part/?ref=eda; DESCRIPTION: Pushbutton Switch DPDT Standard Through Hole; MF: E-Switch; MP: TL2285EE; PACKAGE: None; PRICE: None; PURCHASE-URL: https://www.snapeda.com/api/url_track_click_mouser/?unipart_id=653295&manufacturer=E-Switch&part_name=TL2285EE&search_term= latching straight dpdt switch; SNAPEDA_LINK: https://www.snapeda.com/parts/TL2285EE/E-Switch/view-part/?ref=snap
BT_ANT GSM_ANT = SparkFun-Connectors:CONN_01: Single connection point. Often used as Generic Header-pin footprint for 0.1 inch spaced/style header connections On any of the 0.1 inch spaced packages, you can populate with these: Break Away Headers - Straight <https://www.sparkfun.com/products/116> (PRT-00116) Break Away Male Headers - Right Angle <https://www.sparkfun.com/products/553> (PRT-00553) Female Headers <https://www.sparkfun.com/products/115> (PRT-00115) Break Away Headers - Machine Pin <https://www.sparkfun.com/products/117> (PRT-00117) Break Away Female Headers - Swiss Machine Pin <https://www.sparkfun.com/products/743> (PRT-00743) This device is also useful as a general connection point to wire up your design to another part of your project. Our various solder wires solder well into these plated through hole pads. Hook-Up Wire - Assortment (Stranded, 22 AWG) <https://www.sparkfun.com/products/11375> (PRT-11375) Hook-Up Wire - Assortment (Solid Core, 22 AWG) <https://www.sparkfun.com/products/11367> (PRT-11367) View the entire wire category on our website here <https://www.sparkfun.com/categories/141> Special notes: SMTSO-256-ET is a "flush mount" nut for a 4-40 screw. We mostly use this on specialty testbeds; it is a nice way to connect hardware to your PCB at an adjustable hieght. Also note, the SNAP packages are for using a snappable style connector. We sell a baggie of snaps and they are also used on two LilyPad designs: Snap Assortment - 30 pack (male and female) <https://www.sparkfun.com/products/11347> (DEV-11347) LilyPad Arduino SimpleSnap <https://www.sparkfun.com/products/10941> (DEV-10941) LilyPad SimpleSnap Protoboard <https://www.sparkfun.com/products/10940> (DEV-10940)
C1 = SparkFun-Capacitors:10NF: 0.01uF/10nF/10,000pF ceramic capacitors A capacitor is a passive two-terminal electrical component used to store electrical energy temporarily in an electric field. CAP-09321; PROD_ID: CAP-00867
C2 C3 C9 = rcl:CPOL-EU: POLARIZED CAPACITOR, European symbol; SPICEPREFIX: C
C4 C13 C18-C20 = 06035C104K4T2A:06035C104K4T2A: Capacitor MLCC 0603 100nF 50V Check availability <https://pricing.snapeda.com/parts/06035C104K4T2A/AVX/view-part?ref=eda>; AVAILABILITY: In Stock; CHECK_PRICES: https://www.snapeda.com/parts/06035C104K4T2A/AVX+%252F+Kyocera/view-part/?ref=eda; DESCRIPTION: Capacitor MLCC 0603 100nF 50V | AVX 06035C104K4T2A; MF: AVX; MP: 06035C104K4T2A; PACKAGE: 1608 AVX; PRICE: None; SNAPEDA_LINK: https://www.snapeda.com/parts/06035C104K4T2A/AVX+%252F+Kyocera/view-part/?ref=snap
C8 C10 C11 C15-C17 = rcl:C-EU: CAPACITOR, European symbol; SPICEPREFIX: C
C12 = T495X477K010ATE100:T495X477K010ATE100: Tantalum capacitor [KEMET] T495X477K010ATE100 Tantalum capacitor Check availability <https://pricing.snapeda.com/parts/T495X477K010ATE100/KEMET/view-part?ref=eda>; AVAILABILITY: In Stock; CHECK_PRICES: https://www.snapeda.com/parts/T495X477K010ATE100/KEMET/view-part/?ref=eda; DESCRIPTION: 470uF Solid MnO2 Tantalum Electrolytic Capacitor, 10 V dc +/-10%, T495 Series | KEMET T495X477K010ATE100; MF: KEMET; MP: T495X477K010ATE100; PACKAGE: SMD-2 Kemet; PRICE: None; PURCHASE-URL: https://www.snapeda.com/api/url_track_click_mouser/?unipart_id=554043&manufacturer=KEMET&part_name=T495X477K010ATE100&search_term= 470uf 10v 100mω ±10% case-e-7343 tantalum capacitors rohs; SNAPEDA_LINK: https://www.snapeda.com/parts/T495X477K010ATE100/KEMET/view-part/?ref=snap
C14 C21 = SparkFun-Capacitors:220PF: 220pF/0.22nF ceramic capacitors A capacitor is a passive two-terminal electrical component used to store electrical energy temporarily in an electric field.; PROD_ID: CAP-15725; VALUE: 220pF
C23 C24 C29 C30 = Resistor_Capacitor:TAJB106K016RNJ: CAP TANT 10UF 10% 16V 1411 Manufacturer's datasheet <http://datasheets.avx.com/TAJ.pdf>; CREATED_BY: PCBLayout.com; DIGIKEY_PART_NUMBER: 478-1673-2-ND; MANUFACTURER: AVX Corporation; MPN: TAJB106K016RNJ; PACKAGE: CAP TANT B
CHARGER ESP_RESET GSM_RST = AQ_sensor_GSM:KMR621NGLFS: Tactile Switches 50mA 32VDC 1.9mmH 2N IP67; AVAILABILITY: Unavailable; DESCRIPTION: Tactile Switch SPST-NO Top Actuated Surface Mount; MF: C&K; MP: KMR621NG LFS; PACKAGE: None; PRICE: None
D1 = AQ_sensor_GSM:ON_SEMI_1N4148WS: Small Signal Diodes; CENTROID_NOT_SPECIFIED: No; DATASHEET: https://www.fairchildsemi.com/datasheets/1N/1N4148WS.pdf; DIGIKEY_DESCRIPTION: DIODE GEN PURP 75V 150MA SOD323F; DIGIKEY_PART_NUMBER: 1N4148WSFSCT-ND; IPC_LAND_PATTERN_NAME: SOD250125X70-2; LEAD_FREE: yes; MF: ON Semi; MFG_PACKAGE_IDENT: CASE 477AB; MOUSER_DESCRIPTION: Diodes - General Purpose, Power, Switching Small Signal Diode; MOUSER_PART_NUMBER: 512-1N4148WS; MPN: 1N4148WS; PACKAGE: SOD-323FL; PREFIX: D; ROHS: yes; TEMPERATURE_RANGE_HIGH: +150°C
D2 = AQ_sensor_GSM:ON_SEMICONDUCTOR_MMSZ5231BT1G: ONSC-K1A2-2; CIIVA_IDS: 804101; COMPONENT_LINK_1_DESCRIPTION: Manufacturer URL; COMPONENT_LINK_1_URL: http://www.onsemi.com/; COMPONENT_LINK_3_DESCRIPTION: Package Specification; COMPONENT_LINK_3_URL: http://www.onsemi.com/pub_link/Collateral/425-04.PDF; DATASHEET: http://www.onsemi.com/pub_link/Collateral/MMSZ5221BT1-D.PDF; DATASHEET_VERSION: Rev. 12; FOOTPRINT_VARIANT_NAME_0: Manufacturer Recommended; IMPORTED: yes; IMPORTED_FROM: vault; IMPORT_TS: 1521844429; MF: On Semiconductor; MOUNTING_TECHNOLOGY: Surface Mount; MPN: MMSZ5231BT1G; PACKAGE: SOD-123-2-425-04; PACKAGE_DESCRIPTION: 2-Pin SOD, Body 1.6 x 2.69 mm; PACKAGE_VERSION: Rev. G, 10/2009; PACKING: Tape and Reel; PREFIX: D; P_MAX_W: 0.5; RELEASE_DATE: 1407150685; ROHS: No; VAULT_GUID: 27F6BF34-1EB2-4973-A1B4-1410F52D084D; VAULT_REVISION: BBBB861B-93F7-43FE-93E6-D586C34E6C45; VZ_TYP_V: 5.1
D3 = AQ_sensor_GSM:SEMTECH_SMF05C: TVS Diode Array; CENTROID_NOT_SPECIFIED: No; DATASHEET: http://www.semtech.com/images/datasheet/smf05c.pdf; DIGIKEY_DESCRIPTION: DIODE TVS DIODE 5VWM 12.5VC SC70-6; DIGIKEY_PART_NUMBER: SMF05CCT-ND; JUNCTION_CAPACITANCE: 130pF max; LEAD_FREE: yes; MANUFACTURER_PRODUCT_PAGE: http://www.semtech.com/apps/product.php?pn=SMF05C; MF: Semtech; MFG_PACKAGE_IDENT: SC70-6L; MOUSER_PART_NUMBER: 947-SMF05C.TCT; MPN: SMF05C; PACKAGE: SC-70-6; PREFIX: D; REVERSE_STAND-OFF_VOLTAGE: 5V; ROHS: yes; TEMPERATURE_RANGE_HIGH: +125°C; TEMPERATURE_RANGE_LOW: -55°C
D4 D6 D7 = SS54-HF schottkey Diode:SS54-HF: DIODE SCHOTTKY 5A 40V SMA Source: Datasheet <https://componentsearchengine.com/Datasheets/1/SS54-HF.pdf> Check availability <https://pricing.snapeda.com/parts/SS54-HF/Comchip%20Technology/view-part?ref=eda>; AVAILABILITY: In Stock; CHECK_PRICES: https://www.snapeda.com/parts/SS54-HF/Comchip+Technology/view-part/?ref=eda; DESCRIPTION: Diode Schottky 40 V 5A Surface Mount DO-214AC (SMA); MF: Comchip Technology; MP: SS54-HF; PACKAGE: DO-214AC-214 Comchip Technology; PRICE: None; PURCHASE-URL: https://www.snapeda.com/api/url_track_click_mouser/?unipart_id=5812679&manufacturer=Comchip Technology&part_name=SS54-HF&search_term=ss54; SNAPEDA_LINK: https://www.snapeda.com/parts/SS54-HF/Comchip+Technology/view-part/?ref=snap
EC200_GSM = EC200UCNAB-N05-SNNSA:EC200UCNAB-N05-SNNSA: Check availability <https://pricing.snapeda.com/parts/EC200UCNAB-N05-SNNSA/Quectel/view-part?ref=eda>; AVAILABILITY: In Stock; CHECK_PRICES: https://www.snapeda.com/parts/EC200UCNAB-N05-SNNSA/Quectel/view-part/?ref=eda; DESCRIPTION: Quectel Wireless Solutions External Passive, 1559-1606, GNSS L1, Spiral, -, SMA Male (center pin), Terminal, 50 oe10; MF: Quectel; MP: EC200UCNAB-N05-SNNSA; PACKAGE: None; PRICE: None; SNAPEDA_LINK: https://www.snapeda.com/parts/EC200UCNAB-N05-SNNSA/Quectel/view-part/?ref=snap
GPIO PROG = Connector:PINHD-1X4: PIN HEADER; CATEGORY: Headers; DESCRIPTION: Header, Straight, 4 Position; MANUFACTURER: Generic; MPN: Generic; OPERATING_TEMPERATURE: Generic; PART_STATUS: Active; PITCH: 0.100" (2.54mm); ROHS_COMPLIANCE: Generic; SERIES: Generic; SUB-CATEGORY: Headers, Male Pins; TYPE: Board to Board or Cable, Unshrouded, Through Hole, Straight
GPS GSM = 1909763-1:1909763-1: VAO ITEM, MINI RF HEADER Check availability <https://pricing.snapeda.com/parts/1909763-1/TE%20Connectivity/view-part?ref=eda>; AVAILABILITY: In Stock; CHECK_PRICES: https://www.snapeda.com/parts/1909763-1/TE+Connectivity+AMP+Connectors/view-part/?ref=eda; COMMENT: 1909763-1; DESCRIPTION: U.FL (UMCC) Connector Jack, Male Pin 50 Ohms Surface Mount Solder; MF: TE Connectivity; MP: 1909763-1; PACKAGE: None; PRICE: None; PURCHASE-URL: https://www.snapeda.com/api/url_track_click_mouser/?unipart_id=380488&manufacturer=TE Connectivity&part_name=1909763-1&search_term=1909763; SNAPEDA_LINK: https://www.snapeda.com/parts/1909763-1/TE+Connectivity+AMP+Connectors/view-part/?ref=snap
H1-H4 = AQ_sensor_GSM:MOUNT-PAD-ROUND: MOUNTING PAD, round
J1 = AQ_sensor_GSM:F-1X03-: FEMALE HEADER
J2 = 53261-0871:53261-0871: Connector Header Surface Mount, Right Angle 8 position 0.049" (1.25mm) Check availability <https://pricing.snapeda.com/parts/53261-0871/Molex/view-part?ref=eda>; AVAILABILITY: In Stock; CHECK_PRICES: https://www.snapeda.com/parts/53261-0871/Molex/view-part/?ref=eda; DESCRIPTION: Conn; Rect/PCB; Header; 1.25mm Pitch; W2B; 8 Pos; PicoBlade; SMT; Rt Ang; Tin | Molex Incorporated 53261-0871; MF: Molex; MP: 53261-0871; PACKAGE: None; PRICE: None; SNAPEDA_LINK: https://www.snapeda.com/parts/53261-0871/Molex/view-part/?ref=snap
J3 = PJ-002BH:PJ-002BH: 2.5 mm Center Pin, 5.0 A, Right Angle, Through Hole, Dc Power Jack Connector Check availability <https://pricing.snapeda.com/parts/PJ-002BH/CUI%20Devices/view-part?ref=eda> Check availability <https://pricing.snapeda.com/parts/PJ-002BH/CUI%20Devices/view-part?ref=eda>; AVAILABILITY: In Stock; CHECK_PRICES: https://www.snapeda.com/parts/PJ-002BH/CUI+Devices/view-part/?ref=eda; CUI_PURCHASE_URL: https://www.cuidevices.com/product/interconnect/connectors/dc-power-connectors/jacks/pj-002bh?utm_source=snapeda.com&utm_medium=referral&utm_campaign=snapedaBOM; DESCRIPTION: 2.5 x 6.5 mm, 5.0 A, Horizontal, Through Hole, Dc Power Jack Connector; MF: CUI Devices; MP: PJ-002BH; PACKAGE: None; PRICE: None; PURCHASE-URL: https://www.snapeda.com/api/url_track_click_mouser/?unipart_id=329039&manufacturer=CUI Devices&part_name=PJ-002BH&search_term=dc power jack; SNAPEDA_LINK: https://www.snapeda.com/parts/PJ-002BH/CUI+Devices/view-part/?ref=snap
L1 = Fixed Inductors:784787047: Fixed Inductors WE-PD2SA SMD AECQ200 4.7uH 3.3A 29mOhm Manufacturer's datasheet <https://www.mouser.in/datasheet/2/445/784787047-1368852.pdf>; CREATED_BY: PCBLayout.com; MANUFACTURER: Wurth Elektronik; MPN: 784787047; PACKAGE: 7870
L2 = Fixed Inductors:784778010: FIXED IND 1UH 3.5A 36 MOHM SMD Manufacturer's datasheet <https://katalog.we-online.de/pbs/datasheet/784778010.pdf>; CREATED_BY: PCBLayout.com; DIGIKEY_PART_NUMBER: 732-6740-2-ND; MANUFACTURER: Wurth Electronics Inc.; MPN: 784778010; PACKAGE: 7332
MT2492 = MT2492:MT2492: The MT2492 is a fully integrated, high–efficiency 2A synchronous rectified step-down converter by Eng. Augustine.
PB_IN = AQ_sensor_GSM:10118192-0001LF: Single Port 5 Contact Horizontal Right Angle Shielded Micro B USB 2.0 Connector; AVAILABILITY: Unavailable; DESCRIPTION: USB - micro B USB 2.0 Receptacle Connector 5 Position Surface Mount, Right Angle; MF: Amphenol ICC; MP: 10118192-0001LF; PACKAGE: None; PRICE: None
Q1 = FS8205A:FS8205A: N/A Check availability <https://pricing.snapeda.com/parts/FS8205A/Fortune%20Semiconductor/view-part?ref=eda>; AVAILABILITY: In Stock; CHECK_PRICES: https://www.snapeda.com/parts/FS8205A/Fortune+Semiconductor/view-part/?ref=eda; MF: Fortune Semiconductor; MP: FS8205A; PACKAGE: Package; PRICE: None; SNAPEDA_LINK: https://www.snapeda.com/parts/FS8205A/Fortune+Semiconductor/view-part/?ref=snap
Q2-Q7 = MMBT2222_:MMBT2222*: NPN Transistor Check availability <https://pricing.snapeda.com/parts/MMBT2222/ON%20Semiconductor/view-part?ref=eda>; AVAILABILITY: In Stock; CHECK_PRICES: https://www.snapeda.com/parts/MMBT2222/Onsemi/view-part/?ref=eda; DESCRIPTION: Bipolar (BJT) Transistor NPN 30 V 600 mA 250MHz 300 mW Surface Mount SOT-23-3 (TO-236); MF: ON Semiconductor; MP: MMBT2222; PACKAGE: SOT-23-3 Fairchild Semiconductor; PRICE: None; SNAPEDA_LINK: https://www.snapeda.com/parts/MMBT2222/Onsemi/view-part/?ref=snap
R1-R3 R6-R10 R17 R19 R20 R37 = SparkFun-Resistors:1.20KOHM: 1.20kΩ resistor A resistor is a passive two-terminal electrical component that implements electrical resistance as a circuit element. Resistors act to reduce current flow, and, at the same time, act to lower voltage levels within circuits. - Wikipedia; PROD_ID: RES-08413; VALUE: 1.20k
SIMCARD = 78646-3001:78646-3001: Conn Micro SIM Card SKT 6 POS 2.54mm Solder RA SMD 0.5A/Contact Embossed T/R Check availability <https://pricing.snapeda.com/parts/78646-3001/Molex/view-part?ref=eda>; AVAILABILITY: In Stock; CHECK_PRICES: https://www.snapeda.com/parts/78646-3001/Molex/view-part/?ref=eda; DESCRIPTION: Horizontal Surface Mount Micro SIM Card Connector, with Push In Termination | Molex Incorporated 78646-3001; MF: Molex; MP: 78646-3001; PACKAGE: None; PRICE: None; PURCHASE-URL: https://www.snapeda.com/api/url_track_click_mouser/?unipart_id=75189&manufacturer=Molex&part_name=78646-3001&search_term= 786463001; SNAPEDA_LINK: https://www.snapeda.com/parts/78646-3001/Molex/view-part/?ref=snap
SV1 SV2 = AQ_sensor_GSM:FE15-1: FEMALE HEADER; OC_FARNELL: unknown; OC_NEWARK: unknown
U1 = DW01-P:DW01-P: Check availability <https://pricing.snapeda.com/parts/DW01-P/Fortune/view-part?ref=eda>; AVAILABILITY: In Stock; CHECK_PRICES: https://www.snapeda.com/parts/DW01-P/Fortune+Semiconductor/view-part/?ref=eda; DESCRIPTION: One Cell Lithium-ion/Polymer Battery Protection IC; MF: Fortune; MP: DW01-P; PACKAGE: None; PRICE: None; SNAPEDA_LINK: https://www.snapeda.com/parts/DW01-P/Fortune+Semiconductor/view-part/?ref=snap
U3 = AQ_sensor_GSM:TEXAS_INSTRUMENTS_LM1117IMP-3.3-NOPB: PM-REG-LM1086-SOT4; CIIVA_IDS: 19361124; CODE__IPC: SOT223-4; CODE__JEDEC: TO-261-AA; COMPONENT_LINK_1_DESCRIPTION: Datasheet URL; COMPONENT_LINK_1_URL: http://www.ti.com/general/docs/lit/getliterature.tsp?genericPartNumber=LM1117-N&fileType=pdf; COMP_TYPE: LDO IC; FOOTPRINT_VARIANT_NAME_0: Level C; FOOTPRINT_VARIANT_NAME_1: Level B; FOOTPRINT_VARIANT_NAME_2: Level A; HIGH__RELIABILITY: Y; IMPORTED: yes; IMPORTED_FROM: vault; IMPORT_TS: 1521845365; MF: Texas Instruments; MPN: LM1117IMP-3.3/NOPB; PACKAGE: DCY0004A; PACKAGE_DESCRIPTION: Molded SOT-223, 6.50 x 3.56 x 1.6mm Body, 4 Lead, 2.3mm Pitch; PACKAGE_TOP_MARKING: XYTT*N05B; PIN_COUNT: 4; POWER_WISE: N; PREFIX: U; RELEASE_DATE: 1464077430; ROHS: Yes; VAULT_GUID: 7E820BF6-F141-44C1-8A74-392CB201F257; VAULT_REVISION: 16019014-2FBF-4157-ADF5-B132B4DC413A
U5 = TXS0108EPWR:TXS0108EPWR: Check availability <https://pricing.snapeda.com/parts/TXS0108EPWR/Texas%20Instruments/view-part?ref=eda>; AVAILABILITY: In Stock; CHECK_PRICES: https://www.snapeda.com/parts/TXS0108EPWR/Texas+Instruments/view-part/?ref=eda; DESCRIPTION: 8-bit bidirectional voltage-level shifter for open-drain and push-pull application; MF: Texas Instruments; MP: TXS0108EPWR; PACKAGE: TSSOP-20 Texas Instruments; PRICE: None; PURCHASE-URL: https://www.snapeda.com/api/url_track_click_mouser/?unipart_id=105750&manufacturer=Texas Instruments&part_name=TXS0108EPWR&search_term=txs0108epwr; SNAPEDA_LINK: https://www.snapeda.com/parts/TXS0108EPWR/Texas+Instruments/view-part/?ref=snap
U$2 = IP5306:IP5306: IP5306 2.1A Charging 2.4 A Highly integrated mobile power discharge SOC by Eng. Augustine.

## Net classes
0 default: width 0.2 mm, drill 0.2 mm, clearance 0.2 mm
1 POWER: width 0.4 mm, drill 0.2 mm, clearance 0.2 mm to class 0, clearance 0.2 mm
2 BGA: width 0.2 mm, drill 0.2 mm
3 HCurrent: width 0.4 mm, drill 0.2 mm, clearance 0.2 mm to class 0